# EAGLE design EHcircuit_v1.0 (EAGLE 9.1.0)
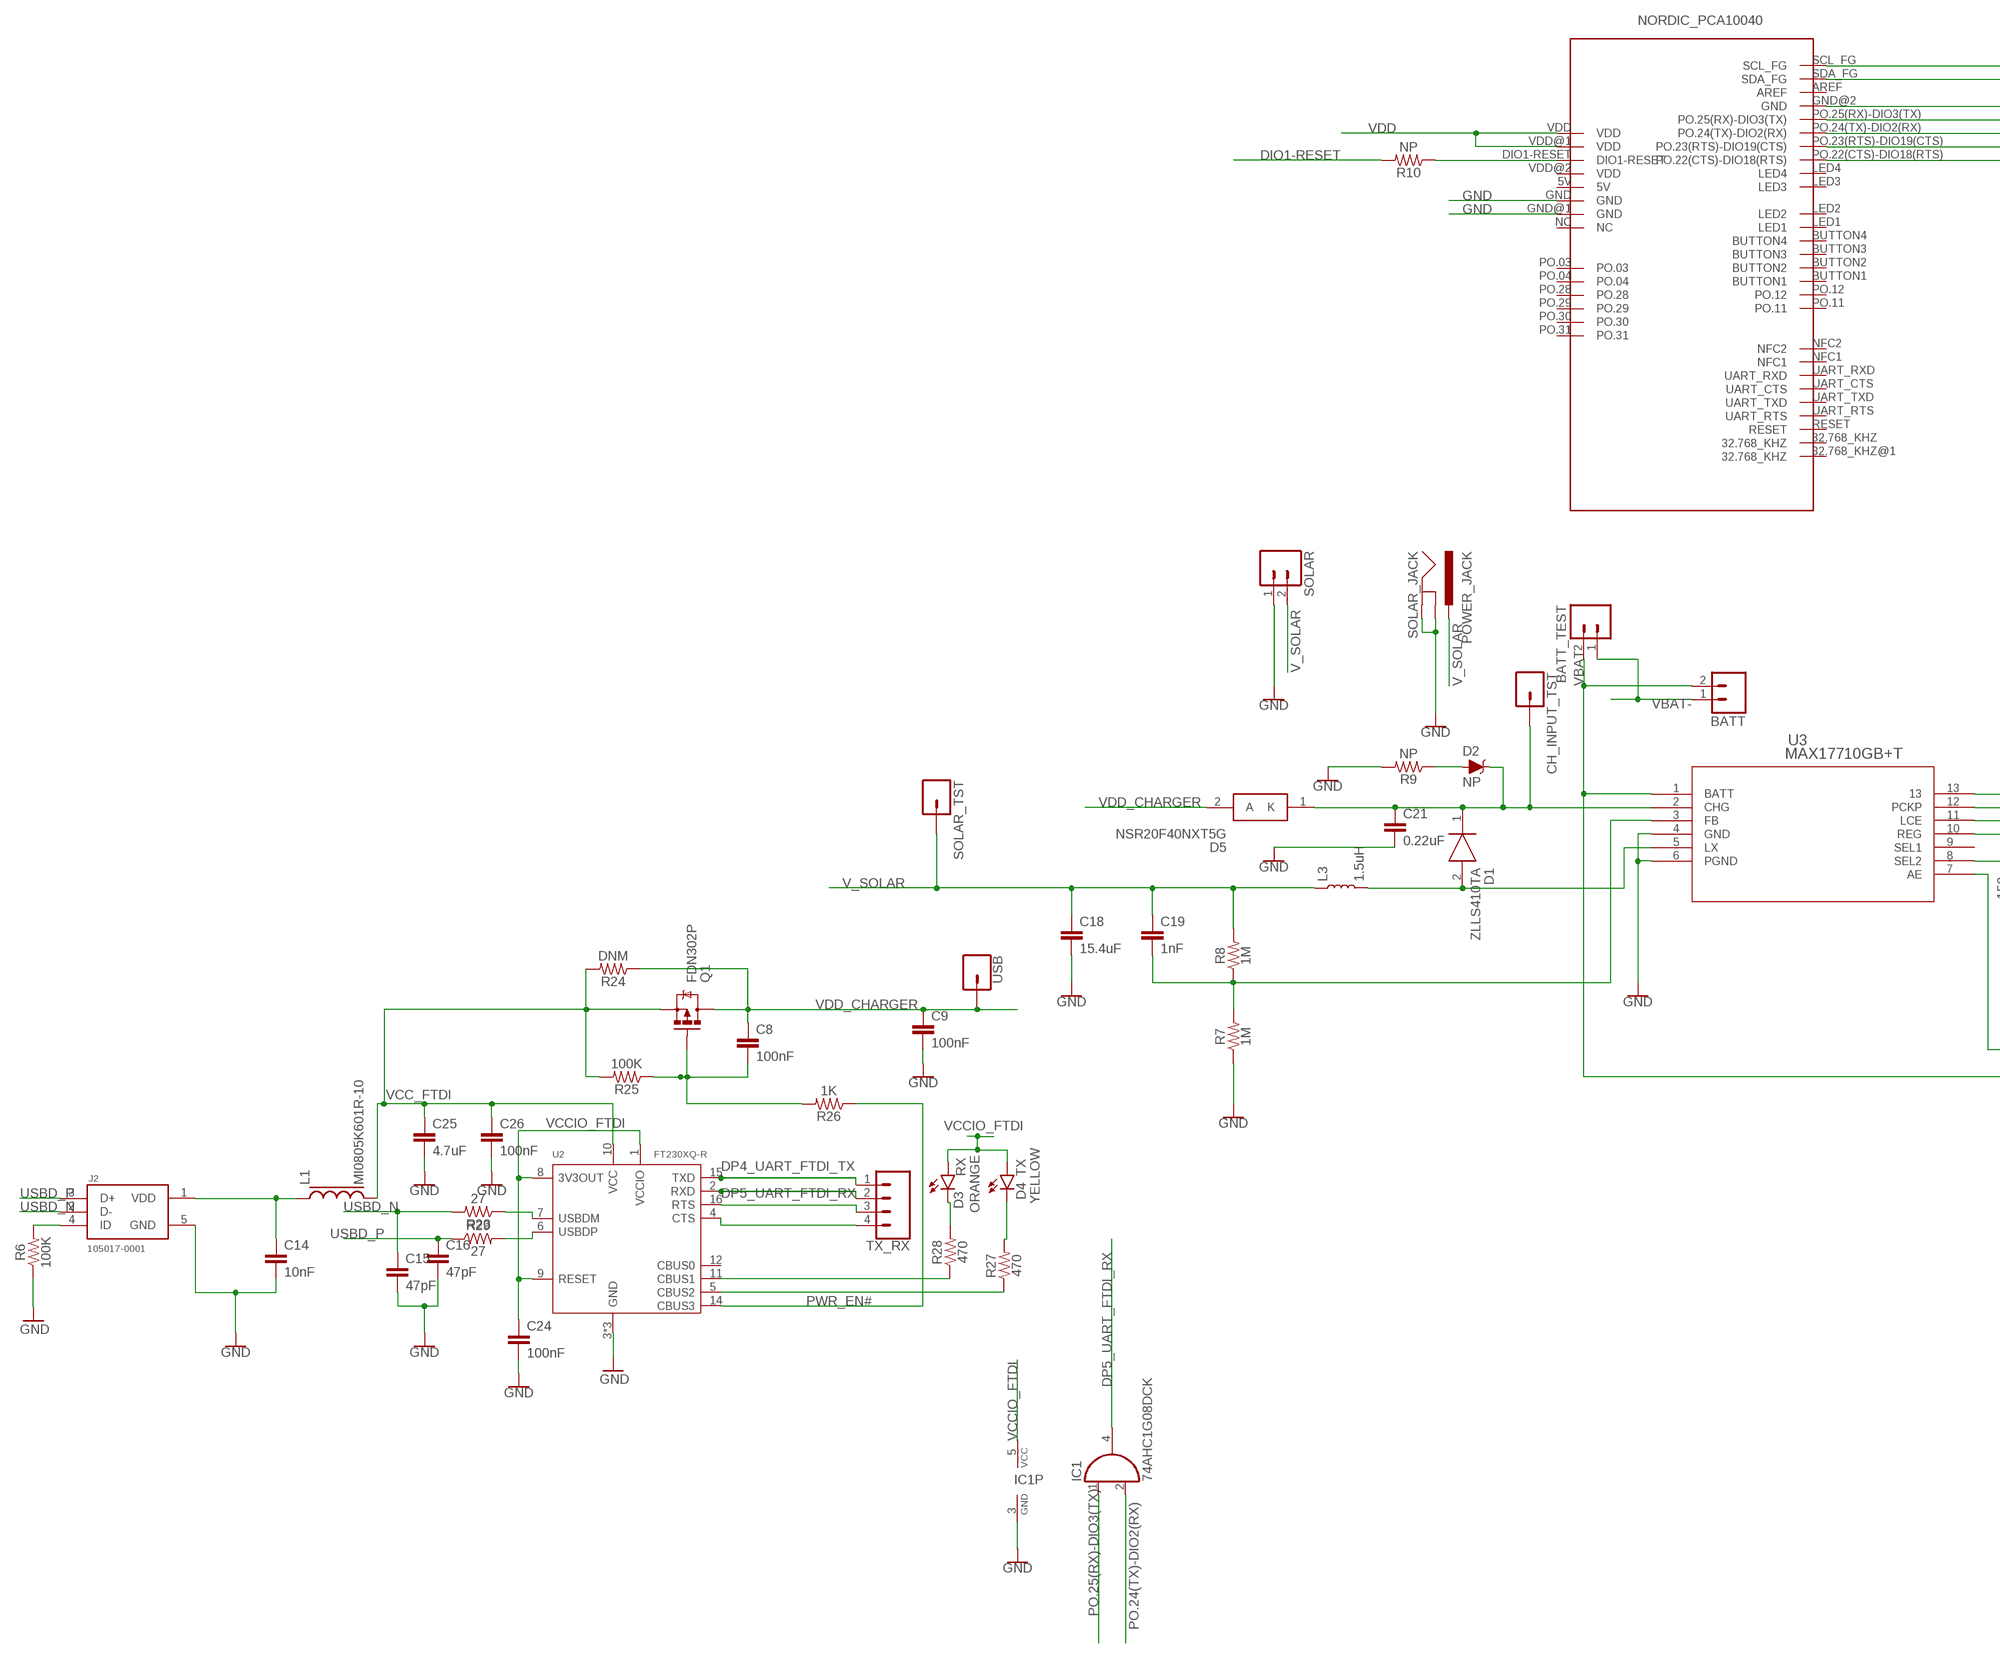
[diagram p0: schematic, sheet 1, part 1 of 2]
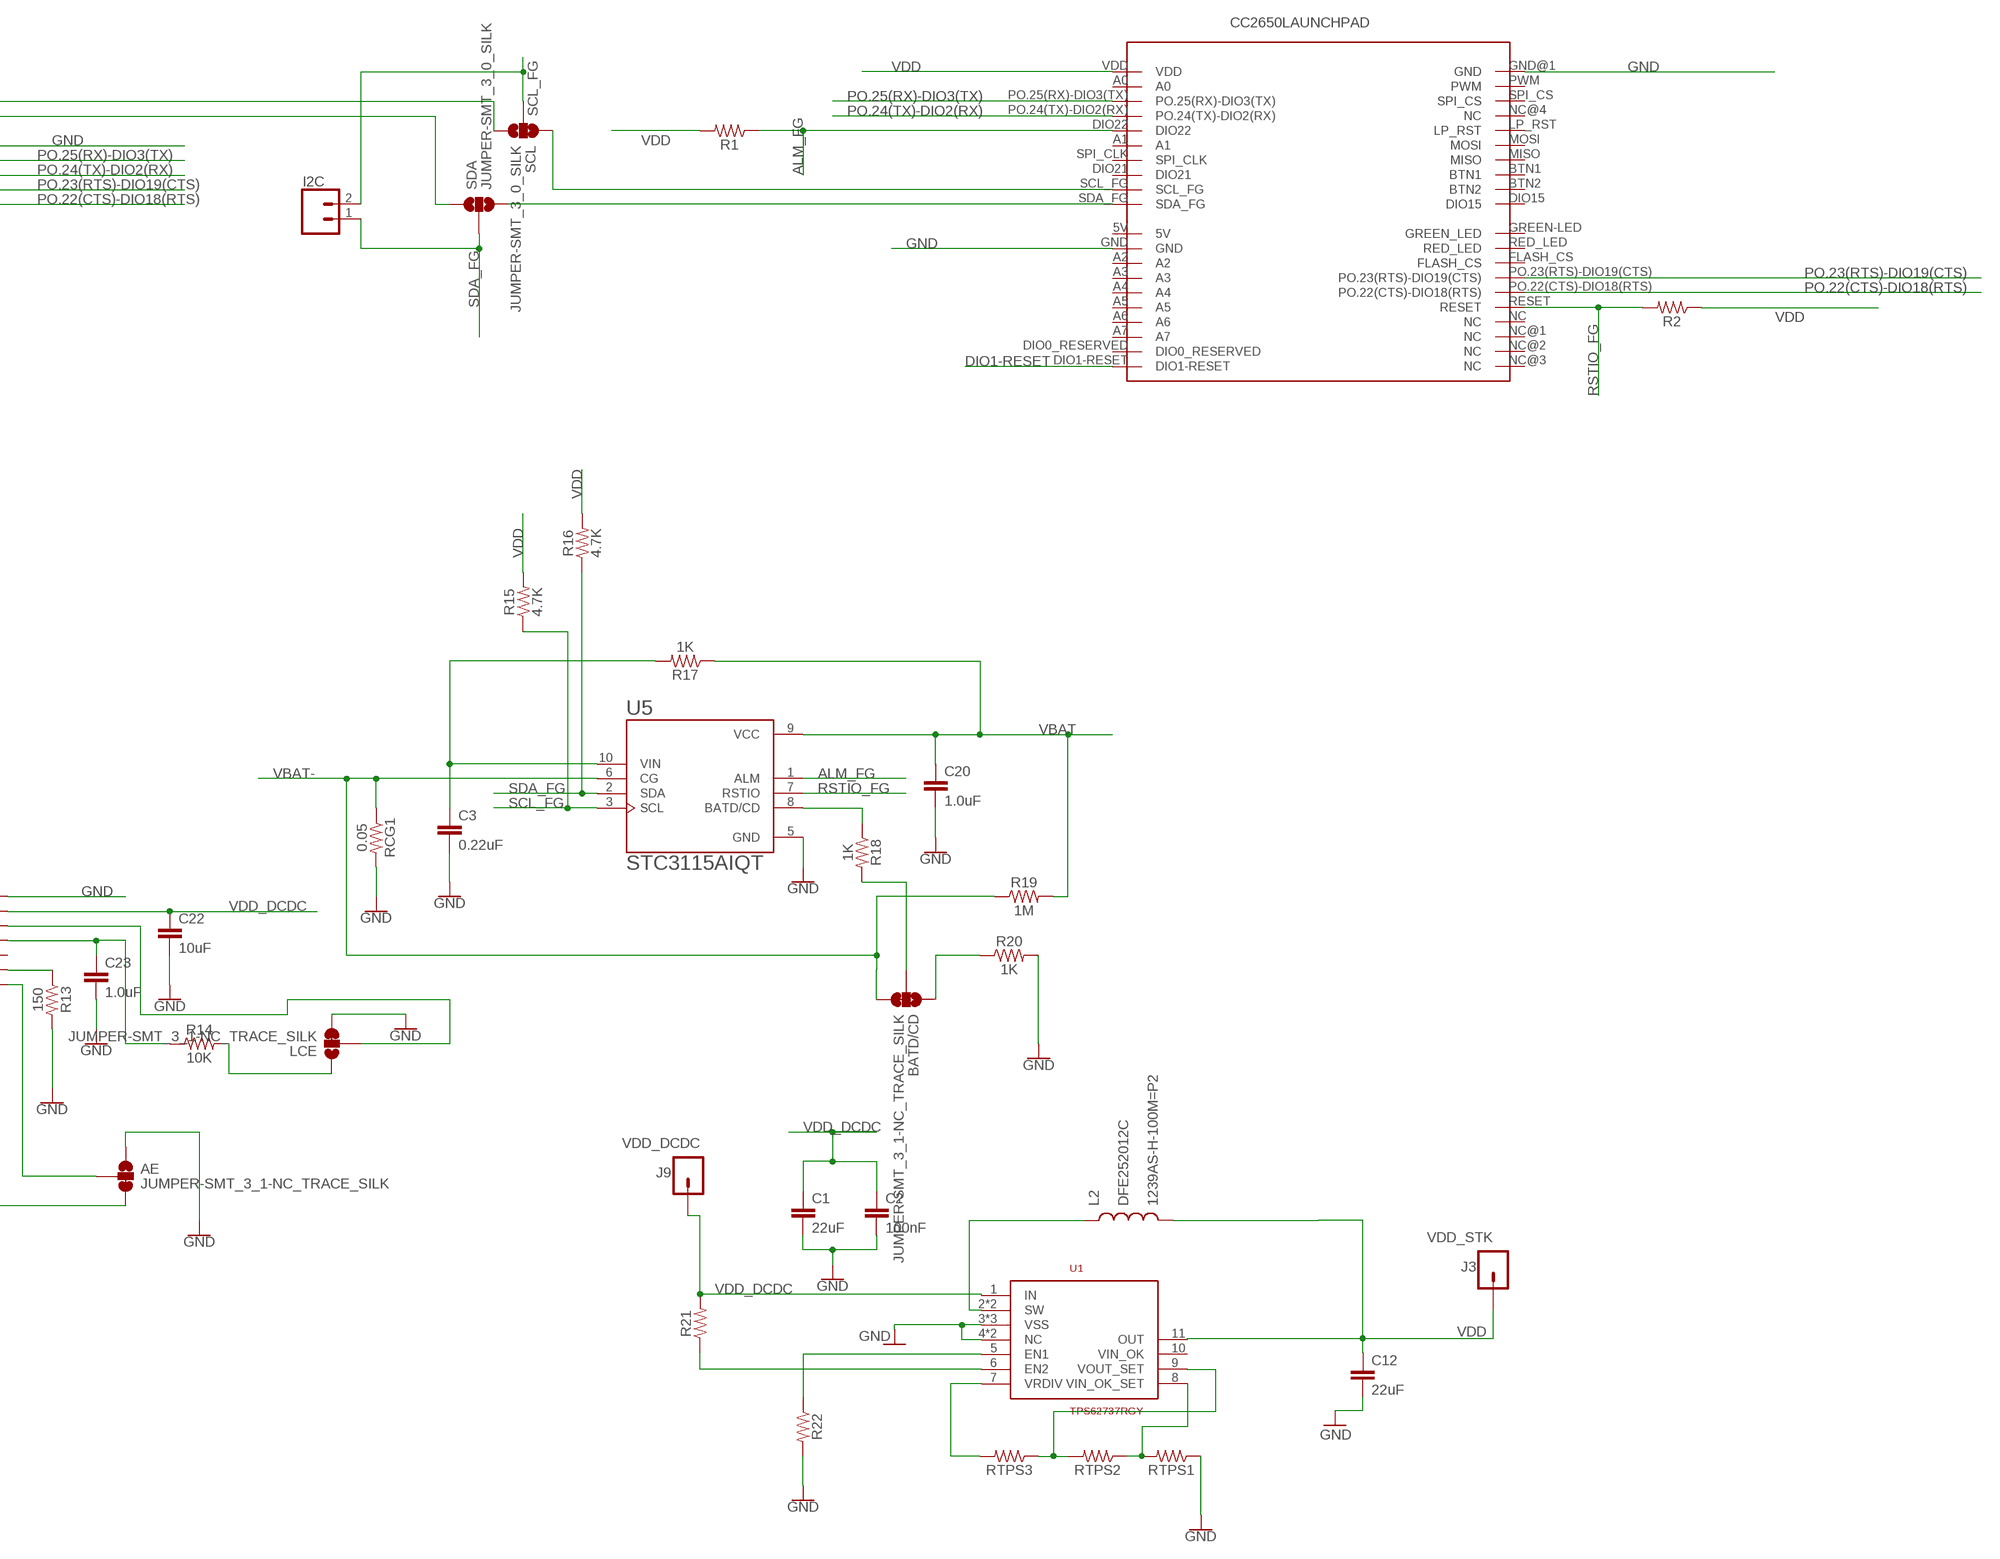
[diagram p1: schematic, sheet 1, part 2 of 2]

## Parts
AE  JUMPER-SMT_3_1-NC_TRACE_SILK  [SMT-JUMPER_3_1-NC_TRACE_SILK]
BATD/CD  JUMPER-SMT_3_1-NC_TRACE_SILK  [SMT-JUMPER_3_1-NC_TRACE_SILK]
BATT  M02-JST-2MM-SMT  [JST-2-SMD@1]
BATT_TEST  M02PTH  [1X02@1]
C1  22uF  10UF-0805-10V-10%  [0805]
C2  100nF  10UF-0805-10V-10%  [0805]
C3  0.22uF  10UF-0805-10V-10%  [0805]
C8  100nF  10UF-0805-10V-10%  [0805]
C9  100nF  10UF-0805-10V-10%  [0805]
C12  22uF  10UF-0805-10V-10%  [0805]
C14  10nF  10UF-0805-10V-10%  [0805]
C15  47pF  10UF-0805-10V-10%  [0805]
C16  47pF  10UF-0805-10V-10%  [0805]
C18  15.4uF  10UF-0805-10V-10%  [0805]
C19  1nF  10UF-0805-10V-10%  [0805]
C20  1.0uF  10UF-0805-10V-10%  [0805]
C21  0.22uF  10UF-0805-10V-10%  [0805]
C22  10uF  10UF-0805-10V-10%  [0805]
C23  1.0uF  10UF-0805-10V-10%  [0805]
C24  100nF  10UF-0805-10V-10%  [0805]
C25  4.7uF  10UF-0805-10V-10%  [0805]
C26  100nF  10UF-0805-10V-10%  [0805]
CH_INPUT_TST  M01PTH  [1X01@1]
D1  ZLLS410TA  [SOD2513X120N]
D2  NP  DIODE-ZENER-MMSZ5232BS  [SOD-323@1]
D3  ORANGE  LED0603  [LED-0603]
D4  YELLOW  LED0603  [LED-0603]
D5  NSR20F40NXT5G  [DSN2_1]
I2C  CONN_02  [1X02]
IC1  74AHC1G08DCK  [SC70-5]
J2  105017-0001  [MOLEX_105017-0001]
J3  M01PTH  [1X01@1]
J9  M01PTH  [1X01@1]
L1  MI0805K601R-10  FERRITE_BREAD  [0805]
L2  1239AS-H-100M=P2  DFE252012C  [DFE252012C]
L3  1.5uH  INDUCTOR  [XFL4020]
LCE  JUMPER-SMT_3_1-NC_TRACE_SILK  [SMT-JUMPER_3_1-NC_TRACE_SILK]
Q1  FDN302P  [SOT23-3]
R1  0.3OHM-0805-1/8W-1%  [0805]
R2  0.3OHM-0805-1/8W-1%  [0805]
R6  100K  0.3OHM-0805-1/8W-1%  [0805]
R7  1M  0.3OHM-0805-1/8W-1%  [0805]
R8  1M  0.3OHM-0805-1/8W-1%  [0805]
R9  NP  0.3OHM-0805-1/8W-1%  [0805]
R10  NP  0.3OHM-0805-1/8W-1%  [0805]
R13  150  0.3OHM-0805-1/8W-1%  [0805]
R14  10K  0.3OHM-0805-1/8W-1%  [0805]
R15  4.7K  0.3OHM-0805-1/8W-1%  [0805]
R16  4.7K  0.3OHM-0805-1/8W-1%  [0805]
R17  1K  0.3OHM-0805-1/8W-1%  [0805]
R18  1K  0.3OHM-0805-1/8W-1%  [0805]
R19  1M  0.3OHM-0805-1/8W-1%  [0805]
R20  1K  0.3OHM-0805-1/8W-1%  [0805]
R21  0.3OHM-0805-1/8W-1%  [0805]
R22  0.3OHM-0805-1/8W-1%  [0805]
R23  27  0.3OHM-0805-1/8W-1%  [0805]
R24  DNM  0.3OHM-0805-1/8W-1%  [0805]
R25  100K  0.3OHM-0805-1/8W-1%  [0805]
R26  1K  0.3OHM-0805-1/8W-1%  [0805]
R27  470  0.3OHM-0805-1/8W-1%  [0805]
R28  470  0.3OHM-0805-1/8W-1%  [0805]
R29  27  0.3OHM-0805-1/8W-1%  [0805]
RB2  CC2650LAUNCHPAD  [SEPS_RB]
RCG1  0.05  0.3OHM-0805-1/8W-1%  [0805]
RTPS1  0.3OHM-0805-1/8W-1%  [0805]
RTPS2  0.3OHM-0805-1/8W-1%  [0805]
RTPS3  0.3OHM-0805-1/8W-1%  [0805]
SCL  JUMPER-SMT_3_0_SILK  [SMT-JUMPER_3_0_NC_TRACE_SILK]
SDA  JUMPER-SMT_3_0_SILK  [SMT-JUMPER_3_0_NC_TRACE_SILK]
SOLAR  M023.5MM  [SCREWTERMINAL-3.5MM-2@1]
SOLAR_JACK  POWER_JACK  [POWER_JACK_PTH]
SOLAR_TST  M01PTH  [1X01@1]
TX_RX  CONN_04  [1X04]
U1  TPS62737RGY  [QFN14]
U2  FT230XQ-R  FT230XQ_2  [QFN16]
U3  MAX17710GB+T  [21-0451C]
U5  STC3115AIQT  [SON50P200X300X60-10]
U$1  PCA10040NORDIC  [SEPS_BB]
USB  CONN_01  [1X01]

## Nets
ALM_FG: R1.1 RB2.DIO22 U5.1(ALM)
DIO1-RESET: R10.2 RB2.DIO1-RESET
DP4_UART_FTDI_TX: TX_RX.1 U2.15(TXD)
DP5_UART_FTDI_RX: IC1.4(O) TX_RX.2 U2.2(RXD)
GND: AE.1 C1.2 C2.2 C3.2 C9.2 C12.2 C14.2 C15.2 C16.2 C18.2 C20.2 C21.2 C22.2 C23.2 C24.2 C25.2 C26.2 IC1.3(GND) J2.5(GND) LCE.3 R6.1 R7.1 R9.2 R13.2 R20.2 R22.2 RB2.GND RB2.GND@1(GND) RCG1.2 RTPS1.1 SOLAR.1 SOLAR_JACK.GND SOLAR_JACK.GNDBREAK U1.3(VSS) U1.4(NC) U1.12(VSS) U1.14(NC) U1.TH_PAD(VSS) U2.3(GND) U2.13(GND) U2.17(GND) U3.4(GND) U3.6(PGND) U3.13 U5.5(GND) U$1.GND U$1.GND@1(GND) U$1.GND@2(GND)
N$1: R28.1 U2.11(CBUS1)
N$2: C14.1 J2.1(VDD) L1.1
N$3: C8.2 Q1.1(G) R25.1 R26.2
N$4: RTPS1.2 RTPS2.1 U1.8(VIN_OK_SET)
N$5: R18.1 U5.8(BATD/CD)
N$6: R22.1 U1.5(EN1)
N$7: D1.2(A) L3.P$2 U3.5(LX)
N$8: D2.A R9.1
N$9: C19.2 R7.2 R8.1 U3.3(FB)
N$10: R21.1 U1.6(EN2)
N$11: L2.P$1 U1.2(SW) U1.13(SW)
N$12: RB2.SCL_FG SCL.1
N$13: C23.1 R14.1 U3.10(REG)
N$14: R27.1 U2.5(CBUS2)
N$15: LCE.2 U3.11(LCE)
N$16: R13.1 U3.8(SEL2)
N$17: LCE.1 R14.2
N$18: J2.4(ID) R6.2
N$19: AE.2 U3.7(AE)
N$20: D3.C R28.2
N$21: R10.1 U$1.DIO1-RESET
N$22: RTPS3.2 U1.7(VRDIV)
N$23: RB2.SDA_FG SDA.3
N$24: D4.C R27.2
N$25: BATD/CD.2 R18.2
N$26: RTPS2.2 RTPS3.1 U1.9(VOUT_SET)
N$27: SDA.1 U$1.SDA_FG
N$28: SCL.3 U$1.SCL_FG
N$29: BATD/CD.1 R20.1
N$30: C21.1 CH_INPUT_TST.1 D1.1(K) D2.C D5.1(K) U3.2(CHG)
N$31: R23.1 U2.7(USBDM)
N$32: R29.2 U2.6(USBDP)
N$33: TX_RX.3 U2.16(RTS)
N$34: C3.1 R17.2 U5.10(VIN)
N$35: TX_RX.4 U2.4(CTS)
PO.22(CTS)-DIO18(RTS): RB2.PO.22(CTS)-DIO18(RTS) U$1.PO.22(CTS)-DIO18(RTS)
PO.23(RTS)-DIO19(CTS): RB2.PO.23(RTS)-DIO19(CTS) U$1.PO.23(RTS)-DIO19(CTS)
PO.24(TX)-DIO2(RX): IC1.2(I1) RB2.PO.24(TX)-DIO2(RX) U$1.PO.24(TX)-DIO2(RX)
PO.25(RX)-DIO3(TX): IC1.1(I0) RB2.PO.25(RX)-DIO3(TX) U$1.PO.25(RX)-DIO3(TX)
PWR_EN#: R26.1 U2.14(CBUS3)
RSTIO_FG: R2.2 RB2.RESET U5.7(RSTIO)
SCL_FG: I2C.2 R15.1 SCL.2 U5.3(SCL)
SDA_FG: I2C.1 R16.1 SDA.2 U5.2(SDA)
USBD_N: C15.1 J2.2(D-) R23.2
USBD_P: C16.1 J2.3(D+) R29.1
V_SOLAR: C18.1 C19.1 L3.P$1 R8.2 SOLAR.2 SOLAR_JACK.PWR SOLAR_TST.1
VBAT: AE.3 BATT.2 BATT_TEST.2 C20.1 R17.1 R19.2 U3.1(BATT) U5.9(VCC)
VBAT-: BATD/CD.3 BATT.1 BATT_TEST.1 R19.1 RCG1.1 U5.6(CG)
VCC_FTDI: C25.1 C26.1 L1.2 Q1.2(S) R24.2 R25.2 U2.10(VCC)
VCCIO_FTDI: C24.1 D3.A D4.A IC1.5(VCC) U2.1(VCCIO) U2.8(3V3OUT) U2.9(RESET)
VDD: C12.1 J3.1 L2.P$2 R1.2 R2.1 R15.2 R16.2 RB2.VDD U1.11(OUT) U$1.VDD U$1.VDD@1(VDD)
VDD_CHARGER: C8.1 C9.1 D5.2(A) Q1.3(D) R24.1 USB.1
VDD_DCDC: C1.1 C2.1 C22.1 J9.1 R21.2 U1.1(IN) U3.12(PCKP)
Unconnected: RB2.5V RB2.A0 RB2.A1 RB2.A2 RB2.A3 RB2.A4 RB2.A5 RB2.A6 RB2.A7 RB2.BTN1 RB2.BTN2 RB2.DIO0_RESERVED RB2.DIO15 RB2.DIO21 RB2.FLASH_CS RB2.GREEN-LED(GREEN_LED) RB2.LP_RST RB2.MISO RB2.MOSI RB2.NC RB2.NC@1(NC) RB2.NC@2(NC) RB2.NC@3(NC) RB2.NC@4(NC) RB2.PWM RB2.RED_LED RB2.SPI_CLK RB2.SPI_CS U1.10(VIN_OK) U2.12(CBUS0) U3.9(SEL1) U$1.5V U$1.32.768_KHZ U$1.32.768_KHZ@1(32.768_KHZ) U$1.AREF U$1.BUTTON1 U$1.BUTTON2 U$1.BUTTON3 U$1.BUTTON4 U$1.LED1 U$1.LED2 U$1.LED3 U$1.LED4 U$1.NC U$1.NFC1 U$1.NFC2 U$1.PO.03 U$1.PO.04 U$1.PO.11 U$1.PO.12 U$1.PO.28 U$1.PO.29 U$1.PO.30 U$1.PO.31 U$1.RESET U$1.UART_CTS U$1.UART_RTS U$1.UART_RXD U$1.UART_TXD U$1.VDD@2(VDD)

## Library data of the parts
AE BATD/CD LCE = SparkFun-Jumpers:JUMPER-SMT_3_1-NC_TRACE: Normally closed trace jumper (1 of 2 connections) This jumper has a trace between two pads so it's normally closed (NC). The other connection is normally open (NO). Use a razor knife to open the connection. For best results follow the IPC guidelines for cutting traces: Cutout at least 0.063 mm (0.005 in). Remove all loose material to clean up the cut area. Seal the cut with an approved epoxy. Reapply solder to reclose the connection, or to close the NO connection.
BATT = SparkFun-Connectors:M02: Standard 2-pin 0.1" header. Use with - straight break away headers ( PRT-00116) - right angle break away headers (PRT-00553) - swiss pins (PRT-00743) - machine pins (PRT-00117) - female headers (PRT-00115) Molex polarized connector foot print use with: PRT-08233 with associated crimp pins and housings. 2.54_SCREWTERM for use with PRT-10571. 3.5mm Screw Terminal footprints for PRT-08084 5mm Screw Terminal footprints for use with PRT-08432; PROD_ID: CONN-11443
BATT_TEST = SparkFun-Connectors:M02: Standard 2-pin 0.1" header. Use with - straight break away headers ( PRT-00116) - right angle break away headers (PRT-00553) - swiss pins (PRT-00743) - machine pins (PRT-00117) - female headers (PRT-00115) Molex polarized connector foot print use with: PRT-08233 with associated crimp pins and housings. 2.54_SCREWTERM for use with PRT-10571. 3.5mm Screw Terminal footprints for PRT-08084 5mm Screw Terminal footprints for use with PRT-08432
C1-C3 C8 C9 C12 C14-C16 C18-C21 C23-C26 = SparkFun-Capacitors:10UF: 10.0µF ceramic capacitors A capacitor is a passive two-terminal electrical component used to store electrical energy temporarily in an electric field.; PROD_ID: CAP-11330; VALUE: 10uF
C22 = SparkFun-Capacitors:10UF: 10.0µF ceramic capacitors A capacitor is a passive two-terminal electrical component used to store electrical energy temporarily in an electric field.; PROD_ID: CAP-11330
CH_INPUT_TST SOLAR_TST = SparkFun-Connectors:M01: Header 1 Standard 1-pin 0.1" header. Use with straight break away headers (SKU : PRT-00116), right angle break away headers (PRT-00553), swiss pins (PRT-00743), machine pins (PRT-00117), and female headers (PRT-00115). SMTSO-256-ET is a "flush mount" nut for a 4-40 screw. The older package used to be too tight, and did not allow it to sit properly thru the drill hit. The latest (0.165DIA) fits nice and snug.
D1 = ZLLS410TA:ZLLS410TA: Diodes Inc ZLLS410TA, SMT Schottky Diode, 10V 750mA, 3ns, 2-Pin SOD-323 Source: Datasheet <http://uk.rs-online.com/web/p/products/1221249>; ARROW_PART_NUMBER: ZLLS410TA; ARROW_PRICE/STOCK: https://www.arrow.com/en/products/zlls410ta/diodes-incorporated; DESCRIPTION: Diodes Inc ZLLS410TA, SMT Schottky Diode, 10V 750mA, 3ns, 2-Pin SOD-323; HEIGHT: 1.2mm; MANUFACTURER_NAME: Diodes Inc.; MANUFACTURER_PART_NUMBER: ZLLS410TA; RS_PART_NUMBER: 1221249; RS_PRICE/STOCK: http://uk.rs-online.com/web/p/products/1221249
D2 = SparkFun-DiscreteSemi:DIODE-ZENER: Zener Diode A Zener diode allows current to flow from its anode to its cathode like a normal semiconductor diode, but it also permits current to flow in the reverse direction when its "Zener voltage" is reached. - WIkipedia; PROD_ID: DIO-12442; VALUE: 5.6V
D3 = SparkFun-LED:LED: LED (Generic) Standard schematic elements and footprints for 5mm, 3mm, 1206, and 0603 sized LEDs. Generic LEDs with no color specified.; COLOR: ORANGE; FUNCTION: RX
D4 = SparkFun-LED:LED: LED (Generic) Standard schematic elements and footprints for 5mm, 3mm, 1206, and 0603 sized LEDs. Generic LEDs with no color specified.; COLOR: YELLOW; FUNCTION: TX
D5 = NSR20F40NXT5G:NSR20F40NXT5G: DSN2 0603 Schottky Diode 40V 2A Source: Datasheet <http://www.onsemi.com/pub/Collateral/NSR20F40-D.PDF>; ARROW_PART_NUMBER: NSR20F40NXT5G; ARROW_PRICE/STOCK: https://www.arrow.com/en/products/nsr20f40nxt5g/on-semiconductor; DESCRIPTION: DSN2 0603 Schottky Diode 40V 2A; HEIGHT: mm; MANUFACTURER_NAME: ON Semiconductor; MANUFACTURER_PART_NUMBER: NSR20F40NXT5G
I2C = SparkFun-Connectors:CONN_02: Multi connection point. Often used as Generic Header-pin footprint for 0.1 inch spaced/style header connections On any of the 0.1 inch spaced packages, you can populate with these: Break Away Headers - Straight <https://www.sparkfun.com/products/116> (PRT-00116) Break Away Male Headers - Right Angle <https://www.sparkfun.com/products/553> (PRT-00553) Female Headers <https://www.sparkfun.com/products/115> (PRT-00115) Break Away Headers - Machine Pin <https://www.sparkfun.com/products/117> (PRT-00117) Break Away Female Headers - Swiss Machine Pin <https://www.sparkfun.com/products/743> (PRT-00743) For SCREWTERMINALS and SPRING TERMINALS visit here: Screw Terimnals on SparkFun.com <https://www.sparkfun.com/search/results?term=Screw+Terminals> (5mm/3.5mm/2.54mm spacing) This device is also useful as a general connection point to wire up your design to another part of your project. Our various solder wires solder well into these plated through hole pads. Hook-Up Wire - Assortment (Stranded, 22 AWG) <https://www.sparkfun.com/products/11375> (PRT-11375) Hook-Up Wire - Assortment (Solid Core, 22 AWG) <https://www.sparkfun.com/products/11367> (PRT-11367) View the entire wire category on our website here <https://www.sparkfun.com/categories/141> Special notes: Molex polarized connector foot print use with: PRT-08233 with associated crimp pins and housings. 2.54_SCREWTERM for use with PRT-10571. 3.5mm Screw Terminal footprints for PRT-08084 5mm Screw Terminal footprints for use with PRT-08432
IC1 = 74xx-little-de:74*1G08: 2-input AND gate
J2 = 105017-0001:105017-0001; AVAILABILITY: Good; DESCRIPTION: Conn USB Type B M 5 POS 0.65mm Solder RA Thru-Hole 5 Terminal 1 Port Embossed T/R; MF: Molex; MP: 105017-0001; PACKAGE: None; PRICE: 0.49 USD
J3 = SparkFun-Connectors:M01: Header 1 Standard 1-pin 0.1" header. Use with straight break away headers (SKU : PRT-00116), right angle break away headers (PRT-00553), swiss pins (PRT-00743), machine pins (PRT-00117), and female headers (PRT-00115). SMTSO-256-ET is a "flush mount" nut for a 4-40 screw. The older package used to be too tight, and did not allow it to sit properly thru the drill hit. The latest (0.165DIA) fits nice and snug.; LABEL: VDD_STK
J9 = SparkFun-Connectors:M01: Header 1 Standard 1-pin 0.1" header. Use with straight break away headers (SKU : PRT-00116), right angle break away headers (PRT-00553), swiss pins (PRT-00743), machine pins (PRT-00117), and female headers (PRT-00115). SMTSO-256-ET is a "flush mount" nut for a 4-40 screw. The older package used to be too tight, and did not allow it to sit properly thru the drill hit. The latest (0.165DIA) fits nice and snug.; LABEL: VDD_DCDC
L1 = davide:FERRITE_BREAD
L2 = davide:DFE252012C; MODEL: DFE252012C
L3 = SparkFun-Coils:INDUCTOR: Inductors Resist changes in electrical current. Basically a coil of wire. SparkFun Products: SparkFun Load Cell Amplifier - HX711 <https://www.sparkfun.com/products/13879> IOIO-OTG - V2.2 <https://www.sparkfun.com/products/13613>
Q1 = davide:FDN302P
R1 R2 R6-R10 R13-R29 RCG1 RTPS1-RTPS3 = SparkFun-Resistors:0.3OHM: 0.3Ω resistor A resistor is a passive two-terminal electrical component that implements electrical resistance as a circuit element. Resistors act to reduce current flow, and, at the same time, act to lower voltage levels within circuits. - Wikipedia; PROD_ID: RES-11622; VALUE: 0.3
RB2 = powersol:CC2650LAUNCHPAD: CC2650 LaunchPad
SCL SDA = powersol:JUMPER-SMT_3_0_SILK
SOLAR = SparkFun-Connectors:M02: Standard 2-pin 0.1" header. Use with - straight break away headers ( PRT-00116) - right angle break away headers (PRT-00553) - swiss pins (PRT-00743) - machine pins (PRT-00117) - female headers (PRT-00115) Molex polarized connector foot print use with: PRT-08233 with associated crimp pins and housings. 2.54_SCREWTERM for use with PRT-10571. 3.5mm Screw Terminal footprints for PRT-08084 5mm Screw Terminal footprints for use with PRT-08432; PROD_ID: CONN-08399
SOLAR_JACK = SparkFun-Connectors:POWER_JACK: Power Jack Connector This is the standard 5.5mm barrel jack for power. The PTH is the most common, proven, reliable, footprint. The Slot footprint only works if the mill layer is transmitted to the PCB fab house so be warned. Here are the connectors we sell at SparkFun: DC Barrel Power Jack/Connector <https://www.sparkfun.com/products/119> (PRT-00119) DC Barrel Power Jack/Connector (SMD) <https://www.sparkfun.com/products/12748> (PRT-12748) DC Barrel Jack Adapter - Breadboard Compatible <https://www.sparkfun.com/products/10811> (PRT-10811) It is used on this SparkFun product (and many, many others): SparkFun RedBoard - Programmed with Arduino <https://www.sparkfun.com/products/12757> (DEV-12757) Also, if you need a mating power supply or connector, please check these out: Wall Adapter Power Supply - 9VDC 650mA <https://www.sparkfun.com/products/298> (TOL-00298) DC Barrel Jack Adapter - Male <https://www.sparkfun.com/products/10287> (PRT-10287); PROD_ID: CONN-08197
TX_RX = SparkFun-Connectors:CONN_04: Multi connection point. Often used as Generic Header-pin footprint for 0.1 inch spaced/style header connections On any of the 0.1 inch spaced packages, you can populate with these: Break Away Headers - Straight <https://www.sparkfun.com/products/116> (PRT-00116) Break Away Male Headers - Right Angle <https://www.sparkfun.com/products/553> (PRT-00553) Female Headers <https://www.sparkfun.com/products/115> (PRT-00115) Break Away Headers - Machine Pin <https://www.sparkfun.com/products/117> (PRT-00117) Break Away Female Headers - Swiss Machine Pin <https://www.sparkfun.com/products/743> (PRT-00743) For SCREWTERMINALS and SPRING TERMINALS visit here: Screw Terimnals on SparkFun.com <https://www.sparkfun.com/search/results?term=Screw+Terminals> (5mm/3.5mm/2.54mm spacing) This device is also useful as a general connection point to wire up your design to another part of your project. Our various solder wires solder well into these plated through hole pads. Hook-Up Wire - Assortment (Stranded, 22 AWG) <https://www.sparkfun.com/products/11375> (PRT-11375) Hook-Up Wire - Assortment (Solid Core, 22 AWG) <https://www.sparkfun.com/products/11367> (PRT-11367) View the entire wire category on our website here <https://www.sparkfun.com/categories/141> Special notes: Molex polarized connector foot print use with SKU : PRT-08231 with associated crimp pins and housings. 1MM SMD Version SKU: PRT-10208; PROD_ID: CONN-09696
U1 = davide:TPS62737RGY
U2 = FT230XQ:FT230XQ_2
U3 = MAX17710:MAX17710GB+T; MANUFACTURER_NAME: Maxim; MANUFACTURER_PART_NUMBER: MAX17710GB+T; VENDOR: Maxim
U5 = STC3115AIQT:STC3115AIQT: STC3115 2.7 V -4.5 V Series Gas gauge IC alarm out for handheld apps-10-DFN; AVAILABILITY: Good; DESCRIPTION: STC3115 2.7 V -4.5 V Series Gas gauge IC alarm out for handheld apps-10-DFN; MF: STMicroelectronics; MP: STC3115AIQT; PACKAGE: DFN-10 STMicroelectronics; PRICE: 1.70 USD
U$1 = powersol:PCA10040NORDIC: Blue Board
USB = SparkFun-Connectors:CONN_01: Single connection point. Often used as Generic Header-pin footprint for 0.1 inch spaced/style header connections On any of the 0.1 inch spaced packages, you can populate with these: Break Away Headers - Straight <https://www.sparkfun.com/products/116> (PRT-00116) Break Away Male Headers - Right Angle <https://www.sparkfun.com/products/553> (PRT-00553) Female Headers <https://www.sparkfun.com/products/115> (PRT-00115) Break Away Headers - Machine Pin <https://www.sparkfun.com/products/117> (PRT-00117) Break Away Female Headers - Swiss Machine Pin <https://www.sparkfun.com/products/743> (PRT-00743) This device is also useful as a general connection point to wire up your design to another part of your project. Our various solder wires solder well into these plated through hole pads. Hook-Up Wire - Assortment (Stranded, 22 AWG) <https://www.sparkfun.com/products/11375> (PRT-11375) Hook-Up Wire - Assortment (Solid Core, 22 AWG) <https://www.sparkfun.com/products/11367> (PRT-11367) View the entire wire category on our website here <https://www.sparkfun.com/categories/141> Special notes: SMTSO-256-ET is a "flush mount" nut for a 4-40 screw. We mostly use this on specialty testbeds; it is a nice way to connect hardware to your PCB at an adjustable hieght. Also note, the SNAP packages are for using a snappable style connector. We sell a baggie of snaps and they are also used on two LilyPad designs: Snap Assortment - 30 pack (male and female) <https://www.sparkfun.com/products/11347> (DEV-11347) LilyPad Arduino SimpleSnap <https://www.sparkfun.com/products/10941> (DEV-10941) LilyPad SimpleSnap Protoboard <https://www.sparkfun.com/products/10940> (DEV-10940)

## Board
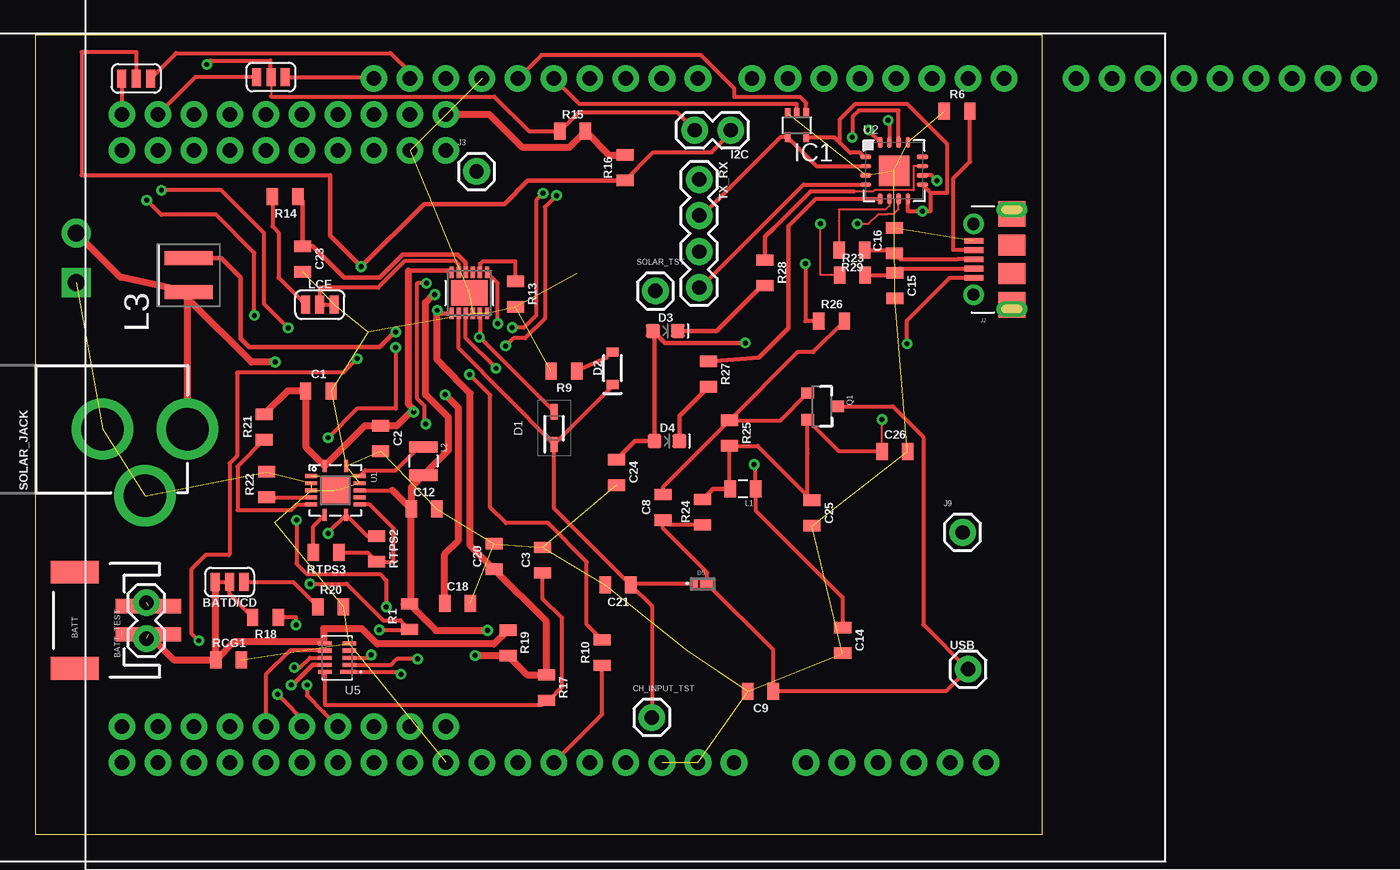
[diagram p2: board, top side]
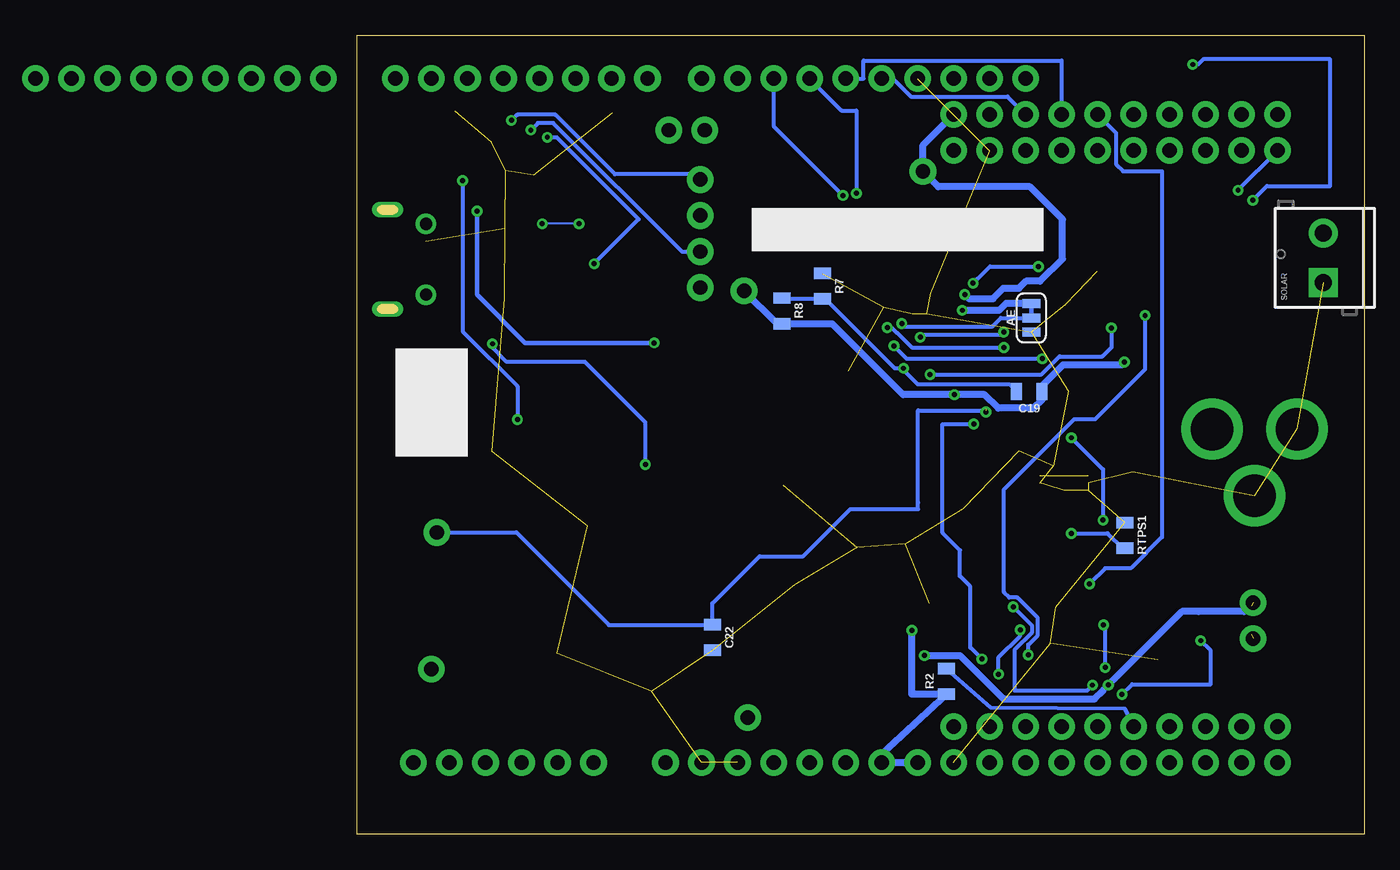
[diagram p3: board, bottom side, seen from below]

Size 71.04 x 56.38 mm. Coordinates in mm from the lower left corner, seen from the top.
Outline: 0,0 71.04,0 71.04,56.38 0,56.38 0,0
Copper layers (1*16): Top 0.035mm / dielectric 1.5mm / Bottom 0.035mm
Design rules "default": minimum track width 6mil, minimum drill 0.35mm, track to track 6mil, track to pad 6mil, pad to pad 6mil, via to via 6mil, smd to smd 6mil, copper to edge 40mil, drill to drill 6mil, minimum pad ring 10mil, minimum via ring 8mil, stop-mask expansion 4mil, vias tented up to drill 0mil, thermal gap 10mil

### Footprints (pad centres in the part's own frame; a part is rotated, then mirrored left to right if it is on the bottom)
SMT-JUMPER_3_1-NC_TRACE_SILK = smd 0.635 x 1.27: 1 -1.016,0; 2 0,0; 3 1.016,0
JST-2-SMD@1 = smd 1 x 4.6: 1 -1,-3.7; 2 1,-3.7 | smd 1.6 x 3.4: NC1 -3.4,1.5; NC2 3.4,1.5
1X02@1 = drill 1.016 pad 1.88: 1 0,0; 2 2.54,0
0805 = smd 0.8 x 1.2: 1 -0.9,0; 2 0.9,0
1X01@1 = drill 1.016 pad 1.88: 1 0,0
SOD2513X120N = smd 1.075 x 0.5: 1 -1.162,0; 2 1.162,0
SOD-323@1 = smd 0.63 x 0.83: A 1.15,0; C -1.15,0
LED-0603 = smd 1 x 1: A -0.877,0; C 0.877,0
DSN2_1 = smd 0.52 x 0.7: 1 -0.59,0 | smd 1.05 x 0.7: 2 0.325,0
1X02 = drill 1.016 pad 1.88: 1 0,0; 2 2.54,0
SC70-5 = smd 0.4 x 0.7: 1 -0.65,-0.85; 2 0,-0.85; 3 0.65,-0.85; 4 0.65,0.85; 5 -0.65,0.85
MOLEX_105017-0001 = smd 0.4 x 1.35: 1 -1.3,2.675; 2 -0.65,2.675; 3 0,2.675; 4 0.65,2.675; 5 1.3,2.675 | drill 0.85 pad 1.45: P$1 -2.5,2.7; P$2 2.5,2.7 | smd 1.5 x 1.9: P$8 -1,0; P$9 1,0 | smd 1.8 x 1.9: P$10 -3.2,0; P$11 3.2,0 | drill 0.6 pad 0.9 long: P$12 -3.5,0; P$13 3.5,0
DFE252012C = smd 0.8 x 2: P$1 -1,0; P$2 1,0
XFL4020 = smd 0.98 x 3.4: P$1 1,1.8; P$2 3.4,1.8
SOT23-3 = smd 0.8 x 0.9: 1 -0.95,-1; 2 0.95,-1; 3 0,1.1
SEPS_RB = drill 1.016 pad 1.88: 5V -24.257,-22.225; A0 -21.717,-24.765; A1 -11.557,-24.765; A2 -19.177,-22.225; A3 -16.637,-22.225; A4 -14.097,-22.225; A5 -11.557,-22.225; A6 -9.017,-22.225; A7 -6.477,-22.225; BTN1 -6.477,20.955; BTN2 -3.937,20.955; DIO0_RESERVED -3.937,-22.225; DIO1-RESET -1.397,-22.225; DIO15 -1.397,20.955; DIO21 -6.477,-24.765; DIO22 -14.097,-24.765; FLASH_CS -19.177,18.415; GND -21.717,-22.225; GND@1 -24.257,20.955; GREEN-LED -24.257,18.415; LP_RST -14.097,20.955; MISO -9.017,20.955; MOSI -11.557,20.955; NC -9.017,18.415; NC@1 -6.477,18.415; NC@2 -3.937,18.415; NC@3 -1.397,18.415; NC@4 -16.637,20.955; PO.22(CTS)-DIO18(RTS) -14.097,18.415; PO.23(RTS)-DIO19(CTS) -16.637,18.415; PO.24(TX)-DIO2(RX) -16.637,-24.765; PO.25(RX)-DIO3(TX) -19.177,-24.765; PWM -21.717,20.955; RED_LED -21.717,18.415; RESET -11.557,18.415; SCL_FG -3.937,-24.765; SDA_FG -1.397,-24.765; SPI_CLK -9.017,-24.765; SPI_CS -19.177,20.955; VDD -24.257,-24.765
SMT-JUMPER_3_0_NC_TRACE_SILK = smd 0.635 x 1.27: 1 -1.016,0; 2 0,0; 3 1.016,0
SCREWTERMINAL-3.5MM-2@1 = drill 1.2 pad 2.032 square: 1 0,0 | drill 1.2 pad 2.032: 2 3.5,0
POWER_JACK_PTH = drill 2.997 pad 4.318: GND 0,7.7; GNDBREAK 4.7,10.7; PWR 0,13.7
1X04 = drill 1.016 pad 1.88: 1 0,0; 2 2.54,0; 3 5.08,0; 4 7.62,0
QFN14 = smd 0.85 x 0.28: 1 -1.725,-0.75; 7 1.725,-0.75; 8 1.725,0.75; 14 -1.725,0.75 | smd 0.28 x 0.85: 2 -1,-1.725; 3 -0.5,-1.725; 4 0,-1.725; 5 0.5,-1.725; 6 1,-1.725; 9 1,1.725; 10 0.5,1.725; 11 0,1.725; 12 -0.5,1.725; 13 -1,1.725 | smd 2 x 2: TH_PAD 0,0
QFN16 = smd 0.8 x 0.35: 1 -2,0.975; 2 -2,0.325; 3 -2,-0.325; 4 -2,-0.975; 9 2,-0.975; 10 2,-0.325; 11 2,0.325; 12 2,0.975 | smd 0.35 x 0.8: 5 -0.975,-2; 6 -0.325,-2; 7 0.325,-2; 8 0.975,-2; 13 0.975,2; 14 0.325,2; 15 -0.325,2; 16 -0.975,2 | smd 2.15 x 2.15: 17 0,0
21-0451C = smd 0.813 x 0.305: 1 -1.448,1.25; 2 -1.448,0.75; 3 -1.448,0.25; 4 -1.448,-0.25; 5 -1.448,-0.75; 6 -1.448,-1.25; 7 1.448,-1.25; 8 1.448,-0.75; 9 1.448,-0.25; 10 1.448,0.25; 11 1.448,0.75; 12 1.448,1.25 | smd 1.803 x 2.591: 13 0,0
SON50P200X300X60-10 = smd 1.16 x 0.26: 1 -0.785,1 | smd 1.01 x 0.26: 2 -0.86,0.5; 3 -0.86,0; 4 -0.86,-0.5; 5 -0.86,-1; 6 0.86,-1; 7 0.86,-0.5; 8 0.86,0; 9 0.86,0.5; 10 0.86,1
SEPS_BB = drill 1.016 pad 1.88: 5V -6.35,-30.48; 32.768_KHZ 43.18,17.78; 32.768_KHZ@1 45.72,17.78; AREF -19.05,17.78; BUTTON1 15.24,17.78; BUTTON2 12.7,17.78; BUTTON3 10.16,17.78; BUTTON4 7.62,17.78; DIO1-RESET -11.43,-30.48; GND -3.81,-30.48; GND@1 -1.27,-30.48; GND@2 -16.51,17.78; LED1 5.08,17.78; LED2 2.54,17.78; LED3 -1.27,17.78; LED4 -3.81,17.78; NC 1.27,-30.48; NFC1 27.94,17.78; NFC2 25.4,17.78; PO.03 6.35,-30.48; PO.04 8.89,-30.48; PO.11 20.32,17.78; PO.12 17.78,17.78; PO.22(CTS)-DIO18(RTS) -6.35,17.78; PO.23(RTS)-DIO19(CTS) -8.89,17.78; PO.24(TX)-DIO2(RX) -11.43,17.78; PO.25(RX)-DIO3(TX) -13.97,17.78; PO.28 11.43,-30.48; PO.29 13.97,-30.48; PO.30 16.51,-30.48; PO.31 19.05,-30.48; RESET 40.64,17.78; SCL_FG -24.13,17.78; SDA_FG -21.59,17.78; UART_CTS 33.02,17.78; UART_RTS 38.1,17.78; UART_RXD 30.48,17.78; UART_TXD 35.56,17.78; VDD -16.51,-30.48; VDD@1 -13.97,-30.48; VDD@2 -8.89,-30.48
1X01 = drill 1.016 pad 1.88: 1 0,0

### Placement (x,y rotation side)
AE  23.47,36.45 90 bottom
BATD/CD  13.69,17.81 180 top
BATT  4.27,15.11 90 top
BATT_TEST  7.82,13.82 90 top
C1  19.96,31.29 0 top
C2  24.36,27.94 270 top
C3  35.79,19.35 90 top
C8  44.28,23.08 90 top
C9  51.16,10.11 180 top
C12  27.41,22.96 0 top
C14  56.95,13.69 270 top
C15  60.63,38.72 270 top
C16  60.6,41.9 90 top
C18  29.77,16.31 0 top
C19  23.63,31.27 180 bottom
C20  32.36,19.61 90 top
C21  41.1,17.6 180 top
C22  45.97,13.89 270 bottom
C23  18.84,40.61 270 top
C24  41,25.54 270 top
C25  54.79,22.68 270 top
C26  60.63,27.03 0 top
CH_INPUT_TST  43.48,8.26 0 top
D1  36.6,28.67 90 top
D2  40.72,32.89 90 top
D3  44.43,35.53 0 top
D4  44.55,27.75 0 top
D5  47.07,17.68 0 top
I2C  49.05,49.69 180 top
IC1  53.71,50.04 180 top
J2  68.88,40.58 90 top
J3  31.12,46.78 0 top
J9  65.4,21.31 0 top
L1  49.91,24.38 180 top
L2  27.36,26.34 270 top
L3  12.61,37.26 90 top
LCE  20.06,37.38 0 top
Q1  55.47,30.2 270 top
R1  26.38,15.37 90 top
R2  29.46,10.79 90 bottom
R6  65.02,51.04 0 top
R7  38.21,38.69 270 bottom
R8  41.08,36.94 270 bottom
R9  37.28,32.71 180 top
R10  39.98,12.83 90 top
R13  33.86,38.12 270 top
R14  17.62,45.01 180 top
R15  37.9,49.61 0 top
R16  41.58,47.04 90 top
R17  36.04,10.36 270 top
R18  16.23,15.33 180 top
R19  33.32,13.51 270 top
R20  20.83,16.07 0 top
R21  16.15,28.75 90 top
R22  16.3,24.69 90 top
R23  57.65,39.48 0 top
R24  47.06,22.74 90 top
R25  48.97,28.32 270 top
R26  56.17,36.22 0 top
R27  47.48,32.48 270 top
R28  51.47,39.63 270 top
R29  57.59,41.22 180 top
RB2  4.7,26.04 180 top
RCG1  13.64,12.32 0 top
RTPS1  16.87,21.11 270 bottom
RTPS2  24.08,20.14 270 top
RTPS3  20.5,19.89 180 top
SCL  16.61,53.44 0 top
SDA  7.11,53.34 180 top
SOLAR  2.87,38.94 90 bottom
SOLAR_JACK  -2.97,28.6 270 top
SOLAR_TST  43.74,38.35 0 top
TX_RX  46.83,46.21 270 top
U1  21.16,24.28 270 top
U2  60.57,46.83 0 top
U3  30.61,38.2 90 top
U5  21.29,12.47 180 top
U$1  48.01,35.56 0 top
USB  65.79,11.66 0 top

### Tracks (layer width: path | path; a pad name or v marks a point on that pad's centre or on a via)
ALM_FG  (via drill 0.35)
  Top 0.152: R1.1 26.34,14.43
  Top 0.27: R1.1 25.73,15.11 24.53,15.11 21.96,17.68 v19.36,17.68 | U5.1 25.61,11.47 v25.78,11.31 | v24.26,14.43 26.34,14.43
  Bottom 0.27: v25.78,11.31 25.78,12.5 24.26,14.03 v24.26,14.43 | RB2.DIO22 17.5,49.5 17.5,47.3 17,46.8 14.26,46.8 14.26,20.98 16.46,18.78 18.26,18.78 v19.36,17.68
DIO1-RESET  (via drill 0.35)
  Top 0.27: R10.2 38.89,14.82 38.89,19.23 36.14,21.97 33.2,21.97 32.08,23.09 32.08,30.99 v30.61,32.46 | v8.89,45.45 13.11,45.45 16.13,42.44 16.13,37.44 v17.83,35.74
  Bottom 0.27: v30.61,32.46 22.75,32.46 21.48,33.73 18.47,33.73 17.83,34.37 v17.83,35.74 | RB2.DIO1-RESET v8.9,45.46 v8.89,45.45
DP4_UART_FTDI_TX  (via drill 0.35)
  Top 0.27: v60.15,50.38 60.24,50.29 U2.15
  Bottom 0.27: TX_RX.1 47.2,46.58 52.85,46.58 57.05,50.78 59.75,50.78 v60.15,50.38
DP5_UART_FTDI_RX
  Top 0.27: U2.2 55.1,47.16 IC1.4 52.54,49.19 47.02,43.67 TX_RX.2
GND  (47 unrouted)
N$1
  Top 0.152: U2.11 61.94,47.16 61.94,45.46 59.2,45.46 59.1,45.36 57.74,45.36
  Top 0.27: 52.1,42.8 54.66,45.36 57.74,45.36
  Top 0.3: R28.1 51.47,42.17 52.1,42.8
N$2  (via drill 0.35)
  Top 0.152: 50.72,26.11 v50.7,26.11
  Top 0.27: C14.1 56.95,16.74 50.81,22.87 L1.1 50.81,26.02 50.72,26.11 | v61.49,34.62 61.49,36.25 64.52,39.28 J2.1
  Bottom 0.152: 61.54,34.42 61.54,34.77 61.49,34.72 v61.49,34.62
  Bottom 0.27: v50.7,26.11 50.7,29.08 54.97,33.35 60.48,33.35 61.54,34.42
N$3
  Top 0.27: R25.1 52.54,29.22 Q1.1 | C8.2 44.28,24.53 R25.1 | R26.2 54.86,34.02 53.77,34.02 R25.1
N$4  (via drill 0.35)
  Top 0.152: 20.65,21.3 v20.65,21.24
  Top 0.27: RTPS2.1 23.42,21.04 U1.8 20.65,21.3
  Bottom 0.27: v20.65,21.24 18.1,21.24 17.07,20.21 RTPS1.2
N$5  (via drill 0.35)
  Top 0.27: U5.8 19.36,12.47 18.67,11.78 v18.27,11.78 | v18.38,14.79 18.38,15.33 R18.1
  Bottom 0.27: v18.27,11.78 18.27,14.68 v18.38,14.79
N$6
  Top 0.152: R22.1
  Top 0.27: R22.1 U1.5
N$7  (via drill 0.35)
  Top 0.152: 31.36,35.07 31.36,35.13
  Top 0.27: U3.5 31.36,35.13 v31.31,35.08 | D1.2 31.36,35.07
  Top 0.3: L3.P$2 13.1,40.66 14.48,39.29 14.48,34.99 15.08,34.39 24.28,34.39 25.34,35.45 v25.42,35.45
  Bottom 0.27: v31.31,35.08 31.14,35.25 25.62,35.25 v25.42,35.45
N$8
  Top 0.152: D2.A 40.31,33.64
  Top 0.27: 40.31,33.64 R9.1
N$9  (via drill 0.35)
  Top 0.27: v32.49,32.89 30.36,35.02 U3.3
  Bottom 0.152: 41.02,37.79 R8.1 | R7.2 38.01,37.79
  Bottom 0.27: C19.2 25.04,31.78 31.49,31.78 32.52,32.8 32.52,32.86 v32.49,32.89 33.11,32.89 34.21,33.99 38.01,37.79 | 37.94,37.79 R7.2 41.02,37.79
N$10
  Top 0.27: R21.1 14.25,25.95 14.25,22.88 18.03,22.88 18.43,23.28 U1.6
N$11  (1 unrouted)
  Top 0.27: 27.06,27.34 25.41,25.68 23.28,25.68 U1.13
  Top 0.5: 27.06,27.34 L2.P$1
N$12
  Top 0.27: SCL.1 11.28,53.44 RB2.SCL_FG
N$13
  Top 0.3: R14.1 18.84,44.68 C23.1 19.56,41.51 21.78,39.29 24.26,39.29 25.9,40.92 29.78,40.92 30.36,40.34 U3.10
N$14
  Top 0.27: U2.5 55.04,44.83 53.13,42.92
  Top 0.3: 53.13,42.92 53.13,35.74 51.04,33.65 R27.1
N$15
  Top 0.27: U3.11 29.86,40.22 29.59,40.48 26.08,40.48 24.18,38.58 20.06,38.58 LCE.2
N$16
  Top 0.27: R13.1 33.86,40.43 31.55,40.43 31.36,40.25 U3.8
N$17
  Top 0.27: R14.2 16.72,42.91 17.15,42.48 17.15,39.28 LCE.1
N$18
  Top 0.27: J2.4 64.74,41.23 64.74,46.26 65.94,47.46 65.94,51.02 R6.2
N$19  (via drill 0.35)
  Top 0.27: v32.61,36.04 32.61,38.89 U3.7
  Bottom 0.27: AE.2 25.63,36.45 26.23,35.85 32.42,35.85 v32.61,36.04
N$20
  Top 0.27: R28.2 51.24,38.73
  Top 0.3: 51.24,38.73 48.04,35.53 D3.C
N$21
  Top 0.27: U$1.DIO1-RESET 39.98,8.48 R10.1
N$22
  Top 0.27: RTPS3.2 19.6,21.75 U1.7
N$23
  Top 0.27: SDA.3 RB2.SDA_FG
N$24
  Top 0.3: D4.C 45.43,29.52 R27.2
N$25
  Top 0.27: R18.2 13.69,16.97 BATD/CD.2
N$26
  Top 0.152: 22.61,19.91 22.58,19.89
  Top 0.27: RTPS3.1 22.58,19.89 23.43,19.89 RTPS2.2 25.28,19.24 25.28,21.59 23.58,23.28 U1.9
N$27
  Top 0.152: 26.42,53.77 U$1.SDA_FG
  Top 0.27: SDA.1 9.93,55.14 25.05,55.14 26.42,53.77
N$28
  Top 0.152: 23.77,53.44 U$1.SCL_FG
  Top 0.27: SCL.3 23.77,53.44
N$29
  Top 0.152: 14.76,17.86 BATD/CD.1
  Top 0.27: BATD/CD.1 18.19,17.81 R20.1
N$30
  Top 0.152: 42.07,17.68 C21.1
  Top 0.27: CH_INPUT_TST.1 43.49,16.11 C21.1 36.6,23 D1.1 | D5.1 42.07,17.68 | D1.1 29.86,34.31 U3.2 | D1.1 40.72,31.63 D2.C
N$31  (via drill 0.35)
  Top 0.152: R23.1 55.38,39.48 v55.38,43.09 | v57.98,43.09 58.78,43.09 59.47,43.78 60.1,43.78 60.11,43.79 60.58,43.79 60.89,44.11 U2.7
  Bottom 0.152: v55.38,43.09 v57.98,43.09
N$32
  Top 0.152: U2.6 60.24,44.36 59.98,44.09 56.68,44.09 56.68,43.3 56.69,43.29 R29.2
N$33  (via drill 0.35)
  Top 0.27: U2.16 58.78,49.65 v58.78,49.7
  Bottom 0.27: TX_RX.3 48.13,41.13 57.2,50.2 58.28,50.2 v58.78,49.7
N$34
  Top 0.152: R17.2 36.22,9.46
  Top 0.27: 36.22,9.46 37.16,10.4 37.16,15.27 35.79,16.64 C3.1 | R17.2 35.7,9.12 20.45,9.12 20.45,11.45 U5.10
N$35
  Top 0.27: U2.4 54.2,45.86 46.93,38.59 TX_RX.4
PO.22(CTS)-DIO18(RTS)  (via drill 0.35)
  Top 0.152: 13.69,19.76 13.64,19.71
  Top 0.27: v36.75,45.08 35.94,44.27 35.94,36.41 34.55,35.02 33.72,35.02 v33.17,34.47 | v22.7,33.57 21.72,32.59 14.22,32.59 14.22,26.72 13.69,26.19 13.69,19.76 | 13.64,19.71 12.01,19.71 11,18.69 11,14.2 v11.52,13.67 | RB2.PO.22(CTS)-DIO18(RTS) 18.8,8.17 17.68,9.29 | 17.68,9.29 v17.08,9.89 | 17.68,9.29
  Bottom 0.27: U$1.PO.22(CTS)-DIO18(RTS) 41.66,49.99 v36.75,45.08 | v33.17,34.47 32.27,33.57 v22.7,33.57 | v17.08,9.89 16.36,10.61 10.82,10.61 10.82,12.97 v11.52,13.67
PO.23(RTS)-DIO19(CTS)  (via drill 0.35)
  Top 0.152: 35.33,36.7 35.33,36.63
  Top 0.27: v35.81,45.24 35.33,44.75 35.33,36.7 | 35.33,36.63 34.47,35.76 v33.63,35.76 | v25.41,34.36 25.41,30.05 22.71,30.05 v20.65,27.99 | v18.42,22.18 18.42,19.1 19.15,18.37 24.31,18.37 24.75,17.93 v24.75,16.06 | RB2.PO.23(RTS)-DIO19(CTS) 20.34,8.61 20.34,8.62 19.15,9.81 v19.15,10.54
  Bottom 0.152: v25.41,34.36 25.26,34.36
  Bottom 0.27: U$1.PO.23(RTS)-DIO19(CTS) 36.86,51.08 35.81,51.08 v35.81,45.24 | v25.41,34.36 31.9,34.36 32.92,35.38 32.95,35.38 33.33,35.76 v33.63,35.76 | v20.65,27.99 18.42,25.76 v18.42,22.18 | v19.15,10.54 19.53,10.16 24.66,10.16 24.66,13.01 23.45,14.22 23.45,14.76 v24.75,16.06
PO.24(TX)-DIO2(RX)
  Top 0.27: IC1.2 53.71,51.54 38.38,51.54 U$1.PO.24(TX)-DIO2(RX)
  Bottom 0.27: U$1.PO.24(TX)-DIO2(RX) 35.31,53.34 35.31,54.61 21.34,54.61 RB2.PO.24(TX)-DIO2(RX)
PO.25(RX)-DIO3(TX)
  Top 0.27: U$1.PO.25(RX)-DIO3(TX) 35.69,54.99 46.94,54.99 49.3,52.63 49.3,52.02 53.95,52.02 54.38,51.6 54.36,51.59 IC1.1
  Bottom 0.27: U$1.PO.25(RX)-DIO3(TX) 33.25,53.34 31.98,52.07 25.15,52.07 RB2.PO.25(RX)-DIO3(TX)
PWR_EN#  (via drill 0.35)
  Top 0.27: U2.14 60.89,51.07 58.08,51.07 57.64,50.64 57.64,49.21 v57.62,49.18 | R26.1 54.31,36.22 v54.31,40.26
  Bottom 0.27: v57.62,49.18 56.95,49.18 51.17,43.4 v54.31,40.26
RSTIO_FG
  Top 0.152: U5.7 20.41,12.98
  Top 0.27: 20.41,12.98 17.96,12.98 16.26,11.28 RB2.RESET
  Bottom 0.27: R2.2 26.37,8.98 16.9,8.88 RB2.RESET
SCL_FG  (via drill 0.35)
  Top 0.152: 16.61,52.07 SCL.2 16.56,53.49
  Top 0.27: 16.61,52.07 32.36,52.07 34.82,49.61 R15.1 38.34,50.95 45.25,50.95 I2C.2 | U5.3 23.49,12.47 v23.7,12.68 | 16.56,53.49 16.56,54.61 12.37,54.61 v12.09,54.33 | v7.85,44.75 8.88,43.72 12.75,43.72 15.45,41.03 v15.45,36.63
  Bottom 0.152: 11.71,54.33 v12.09,54.33
  Bottom 0.27: 25.4,17.09 | 25.4,17.09 25.4,24.36 20.45,29.31 18.96,29.31 15.45,32.83 v15.45,36.63 | 11.71,54.33 11.35,54.69 2.4,54.69 2.4,45.75 6.85,45.75 v7.85,44.75 | v23.7,12.68 23.7,13.38 23.02,14.05 23.02,15.27 24.47,16.72 25.03,16.72 25.4,17.09
SDA_FG  (via drill 0.35)
  Top 0.152: SDA.2 7.14,53.37
  Top 0.27: 7.14,53.37 7.14,55.19 3.25,55.19 3.25,46.51 14.78,46.51 20.78,46.51 | U5.2 25.08,11.97 25.49,12.37 v26.97,12.37 | v27.53,28.96 27.43,29.06 27.43,30.26 26.93,30.76 26.93,38.89 v27.58,38.89 | I2C.1 49.05,49.49 47.7,48.14 43.58,48.14 R16.1
  Top 0.3: 20.78,46.51 20.78,42.27 v22.98,40.07 27.4,44.49 33.08,44.49 34.73,46.14 R16.1
  Bottom 0.27: v26.97,12.37 27.79,13.2 27.79,17.5 28.52,18.24 28.5,18.24 28.5,20.04 29.74,21.28 29.74,28.96 v27.53,28.96 | v22.98,40.07 26.38,40.07 27.27,39.19 27.28,39.19 v27.58,38.89
USBD_N
  Top 0.27: R23.2 60.49,39.48 C15.1 60.91,39.91 60.99,39.92 60.99,39.93 J2.2
USBD_P
  Top 0.152: 65.11,40.61 65.1,40.61 65.08,40.59 65.09,40.59 65.11,40.61
  Top 0.27: 65.11,40.61 60.97,40.61 60.6,40.98 C16.1 60.38,41.22 R29.1 | 65.11,40.61 | 65.11,40.61 | 65.11,40.61 | 65.11,40.61 | 65.11,40.61 | 65.11,40.61 | 65.11,40.61 | 65.11,40.61 | 65.11,40.61 66.18,40.61 J2.3
V_SOLAR  (via drill 0.35)
  Top 0.3: 10.81,37.75 10.81,38.09 | 10.81,38.09 L3.P$1 | 10.73,38.01 10.81,38.09
  Top 0.5: C18.1 28.87,19.78 29.84,20.75 29.84,30.09 v28.91,31.03 | L3.P$1 5.99,39.32 SOLAR.2 | v16.92,33.32 15.24,33.32 10.81,37.75 | SOLAR_JACK.PWR 10.73,38.01
  Bottom 0.152: 28.89,31.04 v28.91,31.03
  Bottom 0.5: v28.91,31.03 32.51,31.03 37.53,36.04 R8.2 41.43,36.04 SOLAR_TST.1 | 28.89,31.04 26.77,31.04 25.81,30.07 23.32,30.07 22.73,30.66 C19.1 22.73,31.63 21.23,33.12 17.12,33.12 v16.92,33.32
VBAT  (via drill 0.35)  (1 unrouted)
  Top 0.152: 31.02,12.61 v31.01,12.62 | U3.1
  Top 0.3: U3.1 28.57,36.75 v28.34,36.98 | U5.9 20.13,11.97 19.56,11.97 18.13,10.54 v18.03,10.54
  Top 0.5: 31.02,12.61 R19.2 34.67,11.26 R17.1 36.04,15.03 C20.1 30.67,20.4 30.67,31.12 28.65,33.14 28.65,33.18 28.34,33.49 v28.34,36.98
  Bottom 0.27: 18.36,10.21 v18.03,10.54
  Bottom 0.5: v18.03,10.54 12.85,15.72 11.66,15.72 8.46,15.72 BATT_TEST.2 | v31.01,12.62 28.5,12.62 25.43,9.56 19.02,9.56 18.36,10.21 | AE.3 25.26,37.46 25.74,36.98 v28.34,36.98
VBAT-  (1 unrouted)
  Top 0.152: 12.67,12.38 RCG1.1
  Top 0.27: 20.33,13.57 U5.6
  Top 0.5: BATT.1 9.76,12.32 RCG1.1 13.99,13.57 20.33,13.57 20.33,14.51 23.04,14.51 24.11,13.43 32.35,13.43 R19.1 | BATD/CD.3 12.67,12.38
VCC_FTDI  (via drill 0.35)
  Top 0.152: C25.1 arc-90 54.47,23.9 | L1.2 48.97,24.5 | C26.1 v59.73,29.27 | 62.59,46.53 U2.10
  Top 0.27: C25.1 50.95,27.42 R25.2 48.97,24.5 | 54.47,23.9 54.47,26.89 54.47,27.16 Q1.2 56.7,27.03 C26.1 | 62.59,46.53 63.19,46.53 v63.59,46.13
  Top 0.3: R24.2 47.8,24.38 L1.2
  Bottom 0.152: 59.69,29.24 v59.73,29.27
  Bottom 0.27: v59.73,29.27 59.73,31.63 63.59,35.49 63.59,45.73 v63.59,46.13
VCCIO_FTDI  (via drill 0.35)
  Top 0.27: U2.1 58.43,47.81 58.15,48.09 57.46,48.09 56.74,48.81 | U2.8 61.54,43.99 v62.58,43.99 63.16,43.99 63.16,45.27 | 63.16,45.27 64.31,45.27 64.31,48.73 63.26,49.77 61.48,51.55 57.84,51.55 56.74,50.45 56.74,48.81 | 63.16,45.27 U2.9 | IC1.5 56.36,49.19 56.44,49.11 56.74,48.81
  Top 0.3: C24.1 42.31,27.75 D4.A 43.67,35.41 D3.A 44.4,34.69 v50.08,34.69
  Bottom 0.3: v50.08,34.69 59.18,34.69 62.58,38.09 v62.58,43.99
VDD  (via drill 0.35)
  Top 0.152: C12.1
  Top 0.27: U1.11 25.19,24.28 | 28.07,38.1 v28.17,38.1
  Top 0.5: R16.2 40.46,47.94 R15.2 37.65,48.46 34.37,48.46 32.03,50.8 RB2.VDD | 25.19,24.28 C12.1 26.51,24.48 L2.P$2 29.13,27.11 29.13,29.41 27.51,31.03 27.51,37.54 28.07,38.1 | 25.98,16.27 R1.2 | R1.2 26.52,16.4 C12.1 | R1.2 28.25,14.4 v31.9,14.4
  Bottom 0.152: 34.04,5.66 U$1.VDD@1
  Bottom 0.5: RB2.VDD 31.12,48.64 J3.1 30.04,45.69 23.57,45.69 21.28,43.41 21.28,40.61 22.86,39.03 23.85,39.03 24.35,38.53 25.45,38.53 26.18,37.8 27.87,37.8 v28.17,38.1 | 34.04,5.66 R2.1 31.9,9.89 v31.9,14.4 | U$1.VDD@1 U$1.VDD
VDD_CHARGER
  Top 0.27: R24.1 44.62,21.84 C8.1 44.28,21.59 47.31,18.56 47.39,18.48 D5.2 52.06,13.01 C9.1 64.24,10.11 USB.1 62.64,14.81 62.64,28.04 60.48,30.2 Q1.3
VDD_DCDC  (via drill 0.35)  (1 unrouted)
  Top 0.3: 26.29,39.77 29.24,39.77 U3.12
  Top 0.5: R21.2 17.79,31.29 C1.1 19.06,27.35 U1.1 23.24,28.84 C2.1 25.5,28.84 26.67,30 26.29,30.37 26.29,37.89 26.29,39.77
  Bottom 0.152: 45.99,14.78 C22.1 | 31.47,29.9 31.45,29.92 | v26.67,29.81 26.67,29.92
  Bottom 0.27: J9.1 59.79,21.31 53.26,14.78 45.99,14.78 | C22.1 45.97,16.31 42.65,19.63 39.57,19.63 36.25,22.96 31.47,22.96 31.47,23.39 31.47,29.9 | 31.45,29.92 26.67,29.92